# Altium schematic sheet 03_SENSORS.SchDoc
size A4; SheetNumber: 5; SheetTotal: 6
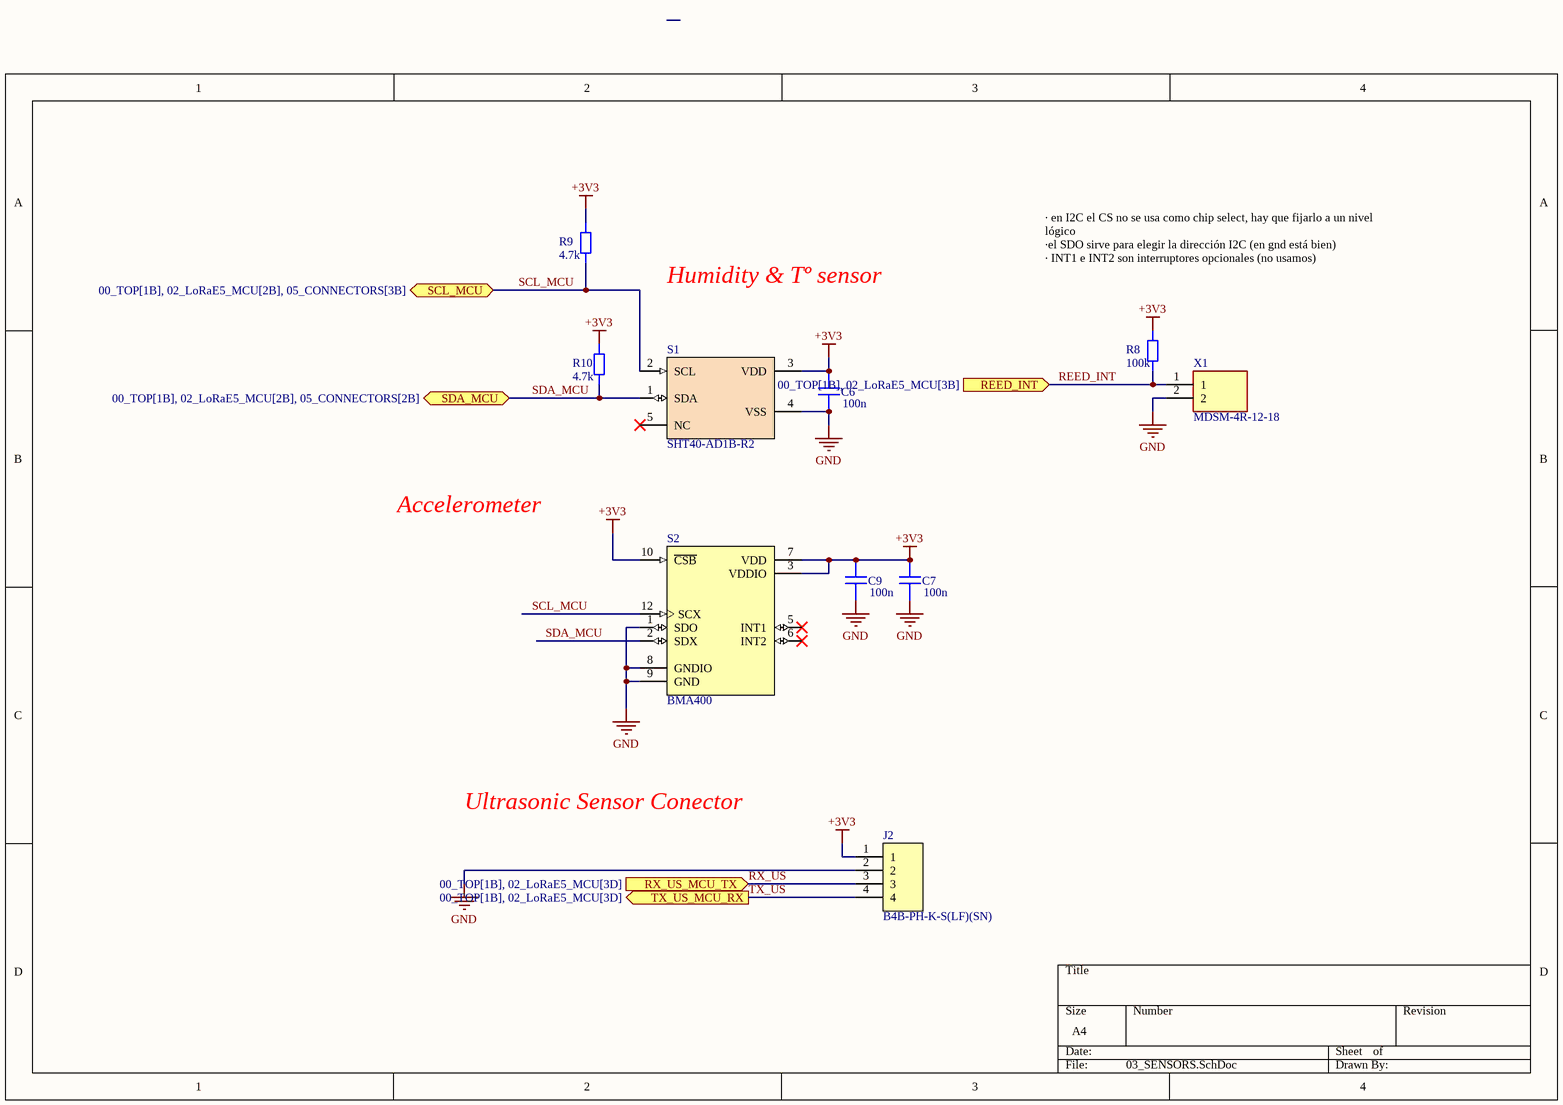
[diagram p0: 03_SENSORS.SchDoc]

## Parts
C6  100n  [Capacitor_SMD:0603_1608m]
C7  100n  [Capacitor_SMD:0603_1608m]
C9  100n  [Capacitor_SMD:0603_1608m]
J2  B4B-PH-K-S(LF)(SN)  [B4B-PH-K-S(LF)(SN)]
R8  100k  [Resistor_SMD:0603_1608m]
R9  4.7k  [Resistor_SMD:0603_1608m]
R10  4.7k  [Resistor_SMD:0603_1608m]
S1  SHT40-AD1B-R2  [SHT4x_SEN]
S2  BMA400  [BMA400]
X1  MDSM-4R-12-18  [MDSM4R1218]

## Ports
REED_INT (in, see 00_TOP[1B], 02_LoRaE5_MCU[3B]), RX_US_MCU_TX (in, see 00_TOP[1B], 02_LoRaE5_MCU[3D]), SCL_MCU (bidir, see 00_TOP[1B], 02_LoRaE5_MCU[2B], 05_CONNECTORS[3B]), SDA_MCU (bidir, see 00_TOP[1B], 02_LoRaE5_MCU[2B], 05_CONNECTORS[2B]), TX_US_MCU_RX (out, see 00_TOP[1B], 02_LoRaE5_MCU[3D])

## Nets
+3V3: C6.1 C7.1 C9.1 J2.1 R8.1 R9.1 R10.1 S1.3(VDD) S2.3(VDDIO) S2.7(VDD) S2.10(~{CSB})
GND: C6.2 C7.2 C9.2 J2.2 S1.4(VSS) S2.1(SDO) S2.8(GNDIO) S2.9(GND) X1.2
REED_INT: R8.2 X1.1 ; port REED_INT
RX_US: J2.3 ; port RX_US_MCU_TX
SCL_MCU: R9.2 S1.2(SCL) S2.12(SCX) ; port SCL_MCU
SDA_MCU: R10.2 S1.1(SDA) S2.2(SDX) ; port SDA_MCU
TX_US: J2.4 ; port TX_US_MCU_RX

Not connected (* = marked no-connect by the designer): S1 5(NC)*; S2 5(INT1)* 6(INT2)*

## Notes on the sheet
- Humidity & Tº sensor
- · en I2C el CS no se usa como chip select, hay que fijarlo a un nivel lógico
  ·el SDO sirve para elegir la dirección I2C (en gnd está bien)
  · INT1 e INT2 son interruptores opcionales (no usamos)
- Accelerometer
- Ultrasonic Sensor Conector

## Library data of the parts
C6 C7 C9 = Generic_Capacitor
R8-R10 = Generic Resistor
X1 = MDSM-4R-12-18: LITTELFUSE - MDSM-4R-12-18 - REED SW, SPST-NO, 0.5A, 200VDC, SMD; Geometry.Height: 2.84mm; Manufacturer_Name: LITTELFUSE; Manufacturer_Part_Number: MDSM-4R-12-18; Mouser Part Number: 934-MDSM-4R12-18; Mouser Price/Stock: https://www.mouser.co.uk/ProductDetail/Littelfuse/MDSM-4R-12-18?qs=nyo4TFax6NeuFOer0%2FvGlw%3D%3D; Arrow Part Number: MDSM-4R-12-18; Arrow Price/Stock: https://www.arrow.com/en/products/mdsm-4r-12-18/littelfuse?region=europe; Datasheet Link: https://media.digikey.com/pdf/DataSheets/HamlinPDFs/MDSM-4R.pdf